# Altium schematic sheet RFID_CC1101_433MHz.SchDoc
size A4
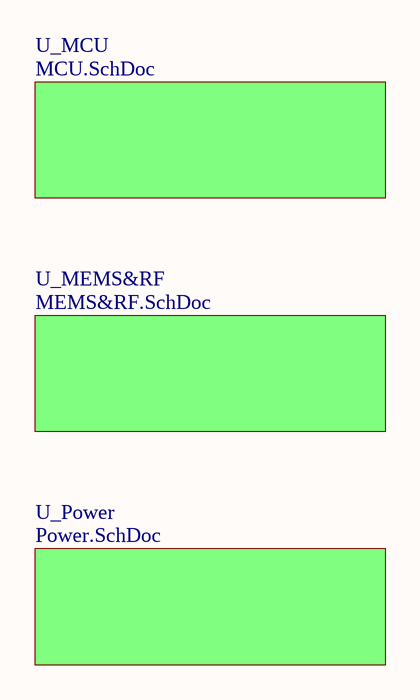
[diagram p0: RFID_CC1101_433MHz.SchDoc]

## Sub-sheets
U_MCU = MCU.SchDoc: no entries
U_MEMS&RF = MEMS&RF.SchDoc: no entries
U_Power = Power.SchDoc: no entries